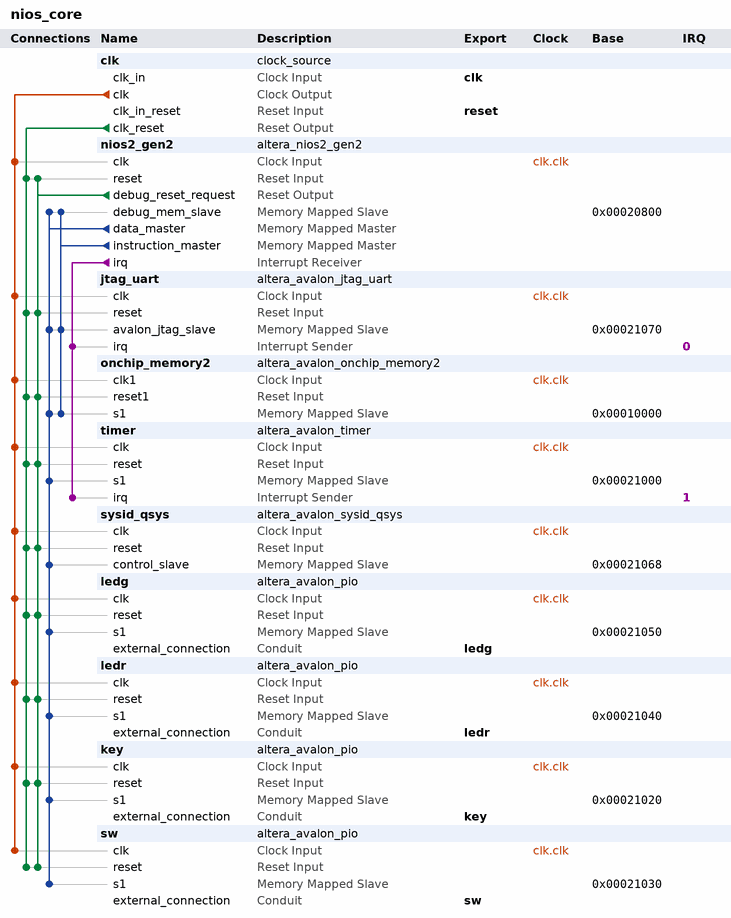
[diagram p0: system contents]
# Platform Designer (Qsys) system nios_core, Cyclone IV E EP4CE115F29C8
# Parameters at their usual value, and those the tool derives, are not listed.
package require -exact qsys 17.1
create_system nios_core
set_project_property DEVICE_FAMILY {Cyclone IV E}
set_project_property DEVICE EP4CE115F29C8

add_instance clk clock_source 17.1
set_instance_parameter_value clk clockFrequency 50000000

add_instance nios2_gen2 altera_nios2_gen2 17.1
set_instance_parameter_value nios2_gen2 dcache_size 2048
set_instance_parameter_value nios2_gen2 exceptionSlave onchip_memory2.s1
set_instance_parameter_value nios2_gen2 icache_size 4096
set_instance_parameter_value nios2_gen2 impl Fast
set_instance_parameter_value nios2_gen2 resetSlave onchip_memory2.s1

add_instance jtag_uart altera_avalon_jtag_uart 17.1
set_instance_parameter_value jtag_uart simInteractiveOptions NO_INTERACTIVE_WINDOWS

add_instance onchip_memory2 altera_avalon_onchip_memory2 17.1
set_instance_parameter_value onchip_memory2 dataWidth 32
set_instance_parameter_value onchip_memory2 dualPort false
set_instance_parameter_value onchip_memory2 initMemContent true
set_instance_parameter_value onchip_memory2 initializationFileName onchip_mem.hex
set_instance_parameter_value onchip_memory2 memorySize 65536

add_instance timer altera_avalon_timer 17.1
set_instance_parameter_value timer period 1
set_instance_parameter_value timer periodUnits MSEC

add_instance sysid_qsys altera_avalon_sysid_qsys 17.1
set_instance_parameter_value sysid_qsys id 1702376594

add_instance ledg altera_avalon_pio 17.1
set_instance_parameter_value ledg direction Output
set_instance_parameter_value ledg width 8

add_instance ledr altera_avalon_pio 17.1
set_instance_parameter_value ledr direction Output
set_instance_parameter_value ledr width 16

add_instance key altera_avalon_pio 17.1
set_instance_parameter_value key direction Input
set_instance_parameter_value key width 4

add_instance sw altera_avalon_pio 17.1
set_instance_parameter_value sw direction Input
set_instance_parameter_value sw width 16

# connections
add_connection clk.clk jtag_uart.clk clock
add_connection clk.clk key.clk clock
add_connection clk.clk ledg.clk clock
add_connection clk.clk ledr.clk clock
add_connection clk.clk nios2_gen2.clk clock
add_connection clk.clk onchip_memory2.clk1 clock
add_connection clk.clk sw.clk clock
add_connection clk.clk sysid_qsys.clk clock
add_connection clk.clk timer.clk clock
add_connection clk.clk_reset jtag_uart.reset reset
add_connection clk.clk_reset key.reset reset
add_connection clk.clk_reset ledg.reset reset
add_connection clk.clk_reset ledr.reset reset
add_connection clk.clk_reset nios2_gen2.reset reset
add_connection clk.clk_reset onchip_memory2.reset1 reset
add_connection clk.clk_reset sw.reset reset
add_connection clk.clk_reset sysid_qsys.reset reset
add_connection clk.clk_reset timer.reset reset
add_connection nios2_gen2.debug_reset_request jtag_uart.reset reset
add_connection nios2_gen2.debug_reset_request key.reset reset
add_connection nios2_gen2.debug_reset_request ledg.reset reset
add_connection nios2_gen2.debug_reset_request ledr.reset reset
add_connection nios2_gen2.debug_reset_request nios2_gen2.reset reset
add_connection nios2_gen2.debug_reset_request onchip_memory2.reset1 reset
add_connection nios2_gen2.debug_reset_request sw.reset reset
add_connection nios2_gen2.debug_reset_request sysid_qsys.reset reset
add_connection nios2_gen2.debug_reset_request timer.reset reset
add_connection nios2_gen2.data_master jtag_uart.avalon_jtag_slave avalon
set_connection_parameter_value nios2_gen2.data_master/jtag_uart.avalon_jtag_slave baseAddress 0x00021070
add_connection nios2_gen2.data_master key.s1 avalon
set_connection_parameter_value nios2_gen2.data_master/key.s1 baseAddress 0x00021020
add_connection nios2_gen2.data_master ledg.s1 avalon
set_connection_parameter_value nios2_gen2.data_master/ledg.s1 baseAddress 0x00021050
add_connection nios2_gen2.data_master ledr.s1 avalon
set_connection_parameter_value nios2_gen2.data_master/ledr.s1 baseAddress 0x00021040
add_connection nios2_gen2.data_master nios2_gen2.debug_mem_slave avalon
set_connection_parameter_value nios2_gen2.data_master/nios2_gen2.debug_mem_slave baseAddress 0x00020800
add_connection nios2_gen2.data_master onchip_memory2.s1 avalon
set_connection_parameter_value nios2_gen2.data_master/onchip_memory2.s1 baseAddress 0x00010000
add_connection nios2_gen2.data_master sw.s1 avalon
set_connection_parameter_value nios2_gen2.data_master/sw.s1 baseAddress 0x00021030
add_connection nios2_gen2.data_master sysid_qsys.control_slave avalon
set_connection_parameter_value nios2_gen2.data_master/sysid_qsys.control_slave baseAddress 0x00021068
add_connection nios2_gen2.data_master timer.s1 avalon
set_connection_parameter_value nios2_gen2.data_master/timer.s1 baseAddress 0x00021000
add_connection nios2_gen2.instruction_master jtag_uart.avalon_jtag_slave avalon
set_connection_parameter_value nios2_gen2.instruction_master/jtag_uart.avalon_jtag_slave baseAddress 0x00021070
add_connection nios2_gen2.instruction_master nios2_gen2.debug_mem_slave avalon
set_connection_parameter_value nios2_gen2.instruction_master/nios2_gen2.debug_mem_slave baseAddress 0x00020800
add_connection nios2_gen2.instruction_master onchip_memory2.s1 avalon
set_connection_parameter_value nios2_gen2.instruction_master/onchip_memory2.s1 baseAddress 0x00010000
add_connection nios2_gen2.irq jtag_uart.irq interrupt
set_connection_parameter_value nios2_gen2.irq/jtag_uart.irq irqNumber 0
add_connection nios2_gen2.irq timer.irq interrupt
set_connection_parameter_value nios2_gen2.irq/timer.irq irqNumber 1

# exported interfaces
add_interface clk clock sink
set_interface_property clk EXPORT_OF clk.clk_in
add_interface key conduit end
set_interface_property key EXPORT_OF key.external_connection
add_interface ledg conduit end
set_interface_property ledg EXPORT_OF ledg.external_connection
add_interface ledr conduit end
set_interface_property ledr EXPORT_OF ledr.external_connection
add_interface reset reset sink
set_interface_property reset EXPORT_OF clk.clk_in_reset
add_interface sw conduit end
set_interface_property sw EXPORT_OF sw.external_connection

set_interconnect_requirement {$system} qsys_mm.clockCrossingAdapter HANDSHAKE
set_interconnect_requirement {$system} qsys_mm.enableEccProtection FALSE
set_interconnect_requirement {$system} qsys_mm.insertDefaultSlave FALSE
set_interconnect_requirement {$system} qsys_mm.maxAdditionalLatency 1

save_system nios_core.qsys
